# EAGLE design seletor (EAGLE 7.6.0)
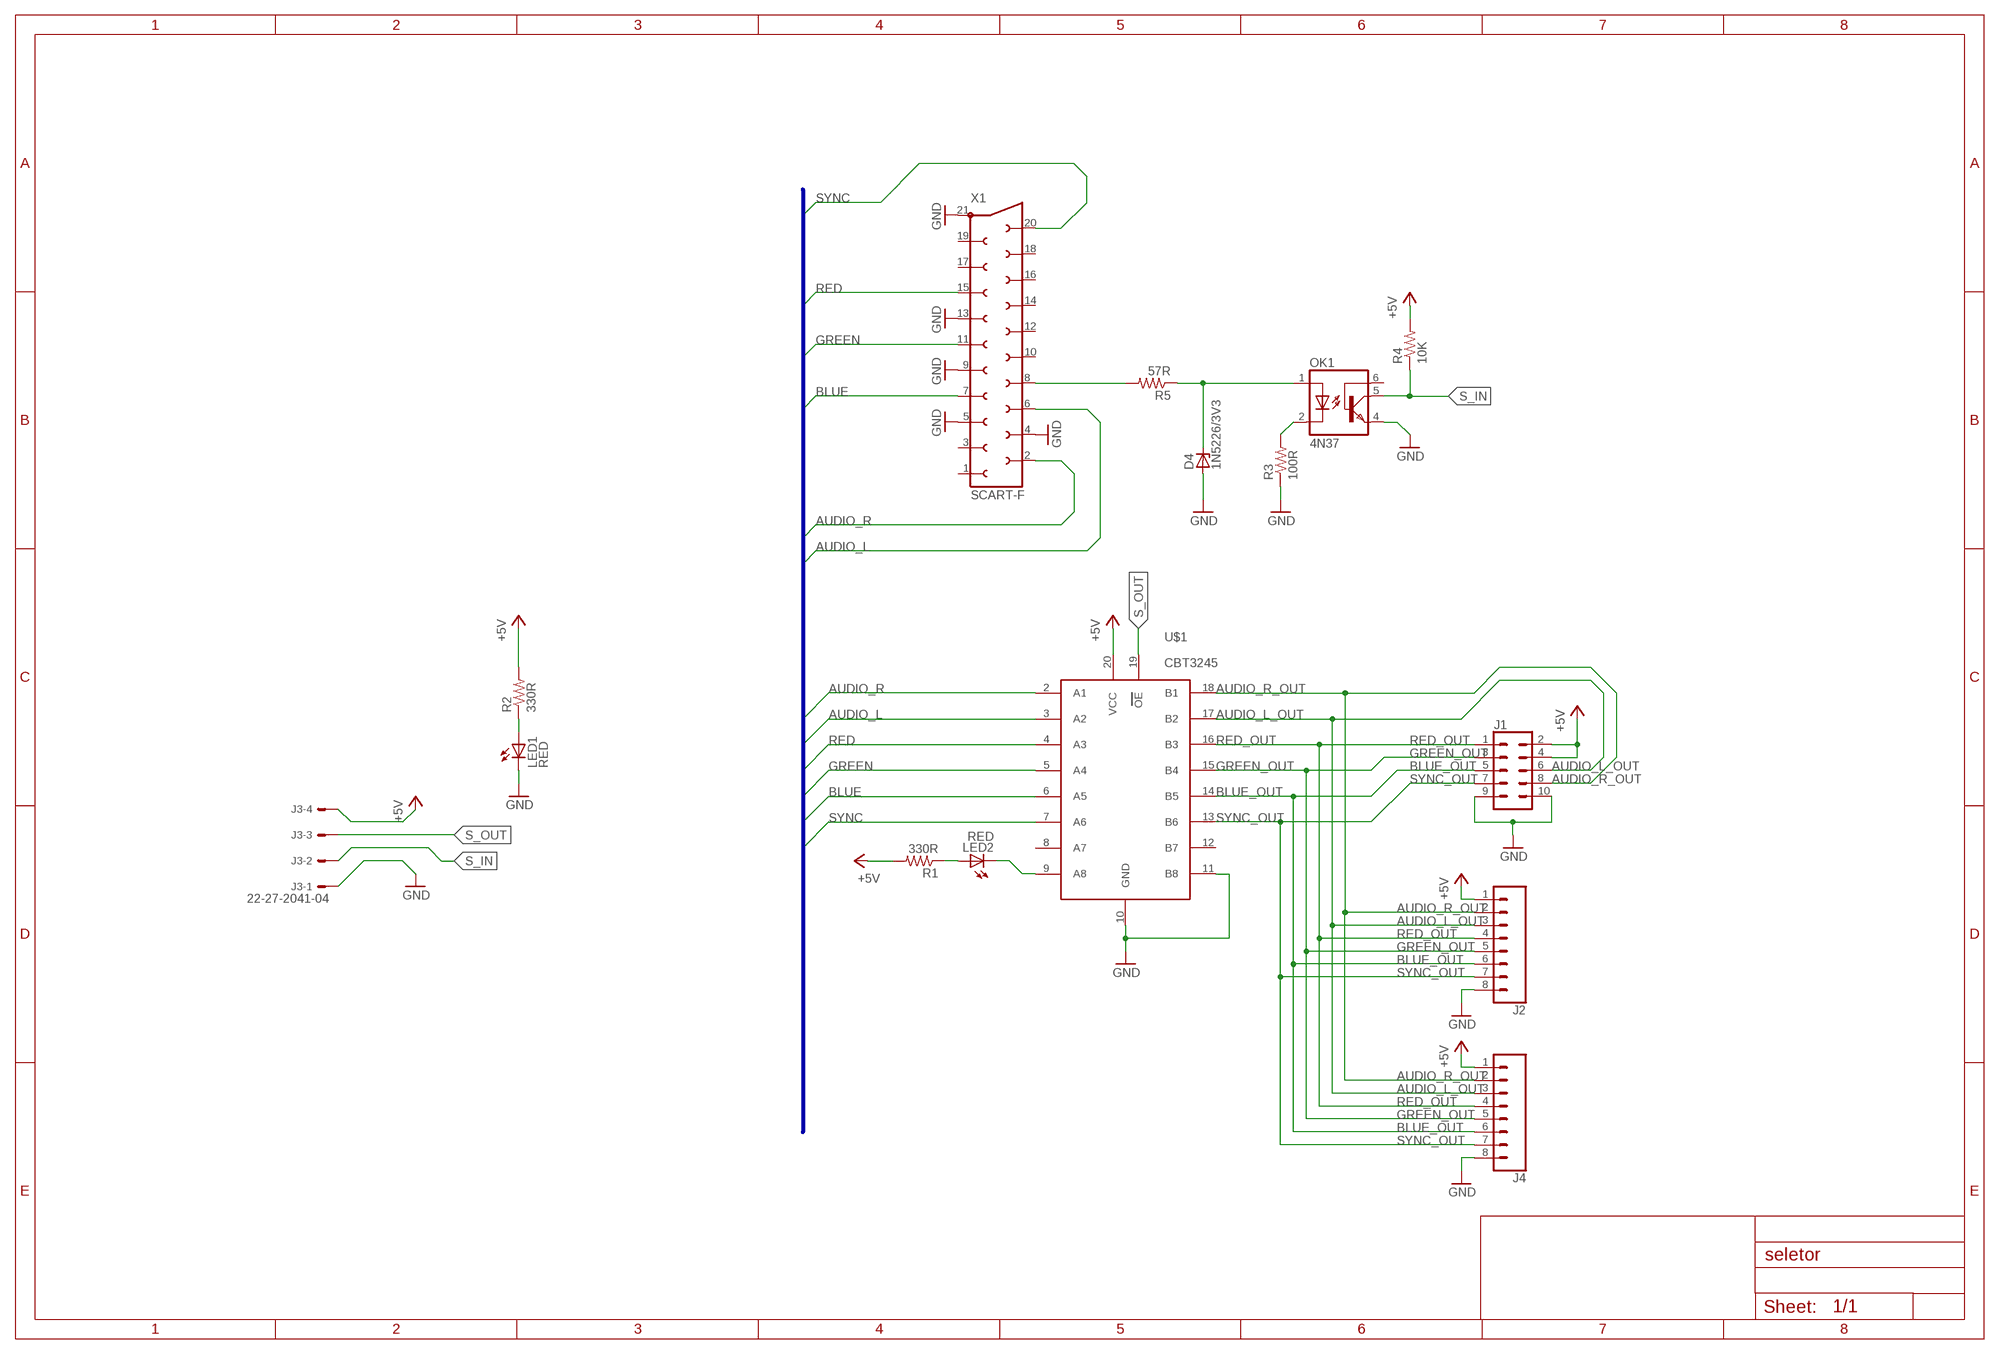
[diagram p0: schematic, sheet 1]

## Parts
D4  1N5226/3V3  BZX90  [DO34Z7]
J1  CONN_05X2SHD  [2X5-SHROUDED]
J2  CONN_08"  [1X08]
J3  22-27-2041-04  [6410-04]
J4  CONN_08"  [1X08]
LED1  RED  LED5MM  [LED5MM]
LED2  RED  LED5MM  [LED5MM]
OK1  4N37  [DIL06]
R1  330R  R-US_0204/2V  [0204V]
R2  330R  R-US_0204/2V  [0204V]
R3  100R  R-US_0204/2V  [0204V]
R4  10K  R-US_0204/2V  [0204V]
R5  57R  R-US_0204/7  [0204/7]
U$1  CBT3245  [SO20]
X1  SCART-F  [SCART-F]

## Nets
+5V [POWER]: J1.2 J1.4 J2.1 J3.4 J4.1 R1.2 R2.2 R4.2 U$1.20(VCC)
AUDIO_L [singal]: U$1.3(A2) X1.6
AUDIO_L_OUT [singal]: J1.6 J2.3 J4.3 U$1.17(B2)
AUDIO_R [singal]: U$1.2(A1) X1.2
AUDIO_R_OUT: J1.8 J2.2 J4.2 U$1.18(B1)
BLUE [singal]: U$1.6(A5) X1.7
BLUE_OUT: J1.5 J2.6 J4.6 U$1.14(B5)
GND [POWER]: D4.A J1.9 J1.10 J2.8 J3.1 J4.8 LED1.K(C) OK1.4(EMI) R3.1 U$1.10(GND) U$1.11(B8) X1.4 X1.5 X1.9 X1.13 X1.21
GREEN [singal]: U$1.5(A4) X1.11
GREEN_OUT: J1.3 J2.5 J4.5 U$1.15(B4)
N$3: LED1.A R2.1
N$4: D4.C OK1.1(A) R5.1
N$5: OK1.2(C) R3.2
N$6: R5.2 X1.8
N$8: LED2.A R1.1
N$12: LED2.K(C) U$1.9(A8)
RED [singal]: U$1.4(A3) X1.15
RED_OUT: J1.1 J2.4 J4.4 U$1.16(B3)
S_IN: J3.2 OK1.5(COL) R4.1
S_OUT: J3.3 U$1.19(OE)
SYNC [singal]: U$1.7(A6) X1.20
SYNC_OUT: J1.7 J2.7 J4.7 U$1.13(B6)
Unconnected: OK1.6(BAS) U$1.8(A7) U$1.12(B7) X1.1 X1.3 X1.10 X1.12 X1.14 X1.16 X1.17 X1.18 X1.19

## Buses
B$1

## Library data of the parts
D4 = diode:BZX90: Z DIODE
J1 = SparkFun-Connectors:CONN_05X2: Multi connection point. Often used as Generic Header-pin footprint for 0.1 inch spaced/style header connections For AVR SPI programming port, see special device with nice symbol: "AVR_SPI_PROG_5x2.dev" You can populate with any combo of single row headers, but if you'd like an exact match, check these: 2x5 AVR ICSP Male Header <https://www.sparkfun.com/products/778> (PRT-00778) 2x5 Pin Shrouded Header <https://www.sparkfun.com/products/8506> (PRT-08506) On any of the 0.1 inch spaced packages, you can populate with these: Break Away Headers - Straight <https://www.sparkfun.com/products/116> (PRT-00116) Break Away Male Headers - Right Angle <https://www.sparkfun.com/products/553> (PRT-00553) Female Headers <https://www.sparkfun.com/products/115> (PRT-00115) Break Away Headers - Machine Pin <https://www.sparkfun.com/products/117> (PRT-00117) Break Away Female Headers - Swiss Machine Pin <https://www.sparkfun.com/products/743> (PRT-00743) Special note: the shrouded connector mates well with our 5x2 ribbon cables: 2x5 Pin IDC Ribbon Cable <https://www.sparkfun.com/products/8535> (PRT-08535); PROD_ID: CONN-08671; SF_ID: PRT-08506
J2 J4 = SparkFun-Connectors:CONN_08: Multi connection point. Often used as Generic Header-pin footprint for 0.1 inch spaced/style header connections On any of the 0.1 inch spaced packages, you can populate with these: Break Away Headers - Straight <https://www.sparkfun.com/products/116> (PRT-00116) Break Away Male Headers - Right Angle <https://www.sparkfun.com/products/553> (PRT-00553) Female Headers <https://www.sparkfun.com/products/115> (PRT-00115) Break Away Headers - Machine Pin <https://www.sparkfun.com/products/117> (PRT-00117) Break Away Female Headers - Swiss Machine Pin <https://www.sparkfun.com/products/743> (PRT-00743) Arduino Stackable Header - 8 Pin <https://www.sparkfun.com/products/9279> (PRT-09279) For SCREWTERMINALS and SPRING TERMINALS visit here: Screw Terimnals on SparkFun.com <https://www.sparkfun.com/search/results?term=Screw+Terminals> (5mm/3.5mm/2.54mm spacing) This device is also useful as a general connection point to wire up your design to another part of your project. Our various solder wires solder well into these plated through hole pads. Hook-Up Wire - Assortment (Stranded, 22 AWG) <https://www.sparkfun.com/products/11375> (PRT-11375) Hook-Up Wire - Assortment (Solid Core, 22 AWG) <https://www.sparkfun.com/products/11367> (PRT-11367) View the entire wire category on our website here <https://www.sparkfun.com/categories/141> Special notes: Molex polarized connector foot print use with SKU : PRT-08231 with associated crimp pins and housings. 1MM SMD Version SKU: PRT-10208 NOTES ON THE VARIANTS LOCK and LOCK_LONGPADS... This footprint was designed to help hold the alignment of a through-hole component (i.e. 6-pin header) while soldering it into place. You may notice that each hole has been shifted either up or down by 0.005 of an inch from it's more standard position (which is a perfectly straight line). This slight alteration caused the pins (the squares in the middle) to touch the edges of the holes. Because they are alternating, it causes a "brace" to hold the component in place. 0.005 has proven to be the perfect amount of "off-center" position when using our standard breakaway headers. Although looks a little odd when you look at the bare footprint, once you have a header in there, the alteration is very hard to notice. Also,if you push a header all the way into place, it is covered up entirely on the bottom side.; PROD_ID: CONN-08438
J3 = con-molex:22-?-04: CONNECTOR wire to board 2.54 mm (.1 inch) pitch header; OC_FARNELL: unknown; OC_NEWARK: unknown
LED1 LED2 = led:LED: LED OSRAM: - CHIPLED LG R971, LG N971, LY N971, LG Q971, LY Q971, LO R971, LY R971 LH N974, LH R974 LS Q976, LO Q976, LY Q976 LO Q996 - Hyper CHIPLED LW Q18S LB Q993, LB Q99A, LB R99A - SideLED LS A670, LO A670, LY A670, LG A670, LP A670 LB A673, LV A673, LT A673, LW A673 LH A674 LY A675 LS A676, LA A676, LO A676, LY A676, LW A676 LS A679, LY A679, LG A679 - Hyper Micro SIDELED® LS Y876, LA Y876, LO Y876, LY Y876 LT Y87S - SmartLED LW L88C, LW L88S LB L89C, LB L89S, LG L890 LS L89K, LO L89K, LY L89K LS L896, LA L896, LO L896, LY L896 - TOPLED LS T670, LO T670, LY T670, LG T670, LP T670 LSG T670, LSP T670, LSY T670, LOP T670, LYG T670 LG T671, LOG T671, LSG T671 LB T673, LV T673, LT T673, LW T673 LH T674 LS T676, LA T676, LO T676, LY T676, LB T676, LH T676, LSB T676, LW T676 LB T67C, LV T67C, LT T67C, LS T67K, LO T67K, LY T67K, LW E67C LS E67B, LA E67B, LO E67B, LY E67B, LB E67C, LV E67C, LT E67C LW T67C LS T679, LY T679, LG T679 LS T770, LO T770, LY T770, LG T770, LP T770 LB T773, LV T773, LT T773, LW T773 LH T774 LS E675, LA E675, LY E675, LS T675 LS T776, LA T776, LO T776, LY T776, LB T776 LHGB T686 LT T68C, LB T68C - Hyper Mini TOPLED® LB M676 - Mini TOPLED Santana® LG M470 LS M47K, LO M47K, LY M47K Source: http://www.osram.convergy.de LUXEON: - LUMILED® LXK2-PW12-R00, LXK2-PW12-S00, LXK2-PW14-U00, LXK2-PW14-V00 LXK2-PM12-R00, LXK2-PM12-S00, LXK2-PM14-U00 LXK2-PE12-Q00, LXK2-PE12-R00, LXK2-PE12-S00, LXK2-PE14-T00, LXK2-PE14-U00 LXK2-PB12-K00, LXK2-PB12-L00, LXK2-PB12-M00, LXK2-PB14-N00, LXK2-PB14-P00, LXK2-PB14-Q00 LXK2-PR12-L00, LXK2-PR12-M00, LXK2-PR14-Q00, LXK2-PR14-R00 LXK2-PD12-Q00, LXK2-PD12-R00, LXK2-PD12-S00 LXK2-PH12-R00, LXK2-PH12-S00 LXK2-PL12-P00, LXK2-PL12-Q00, LXK2-PL12-R00 Source: www.luxeon.com KINGBRIGHT: KA-3528ASYC Source: www.kingbright.com
OK1 = optocoupler:4N37: OPTO COUPLER Source: http://www.fairchildsemi.com/pf/4N/4N35-M.html; MF: FAIRCHILD SEMICONDUCTOR; MPN: 4N37; OC_FARNELL: 1612456; OC_NEWARK: 72K9948
R1-R5 = rcl:R-US_: RESISTOR, American symbol
U$1 = CBT3245:CBT3245
X1 = con-hirschmann:SCART-F: TV SCART CONNECTOR; OC_FARNELL: unknown; OC_NEWARK: unknown

## Net classes
0 default: width 0.406 mm
1 singal: width 0.5 mm
2 POWER: width 0.5 mm

## Board
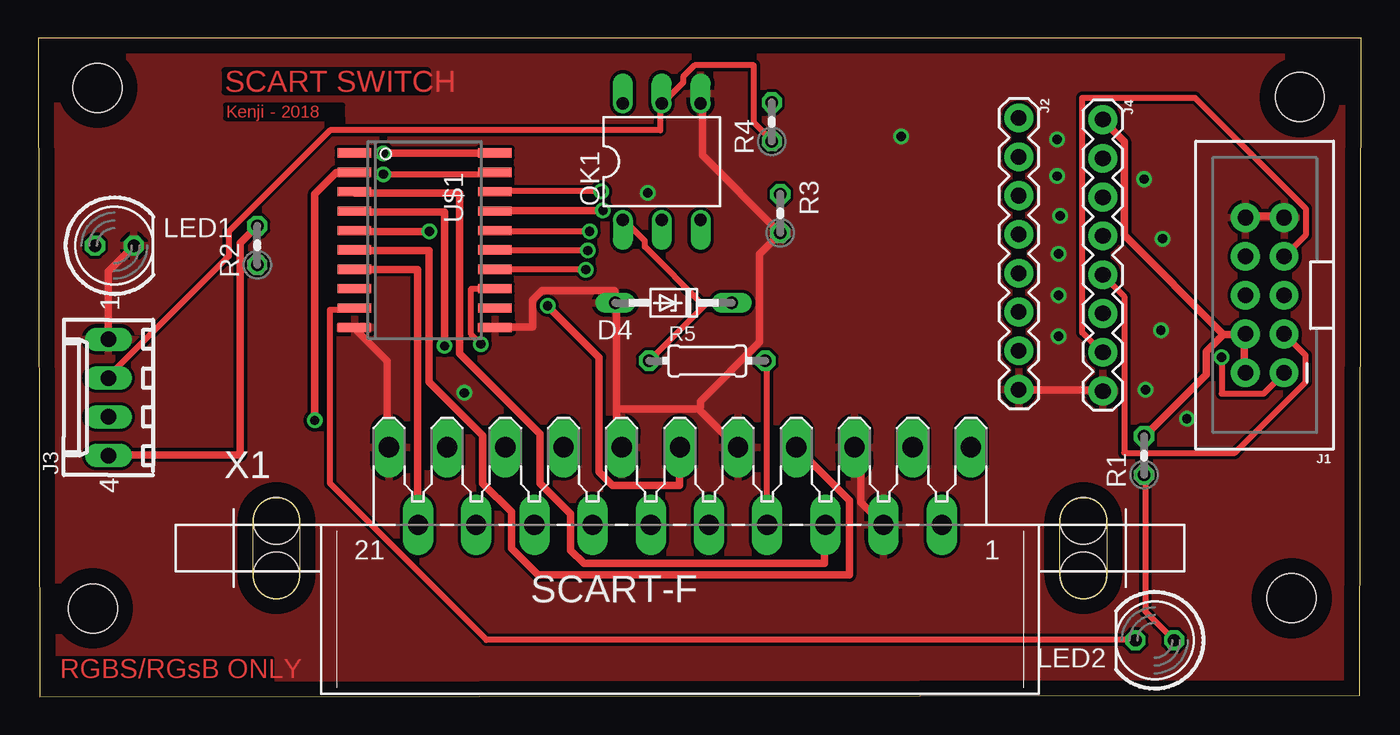
[diagram p1: board, top side]
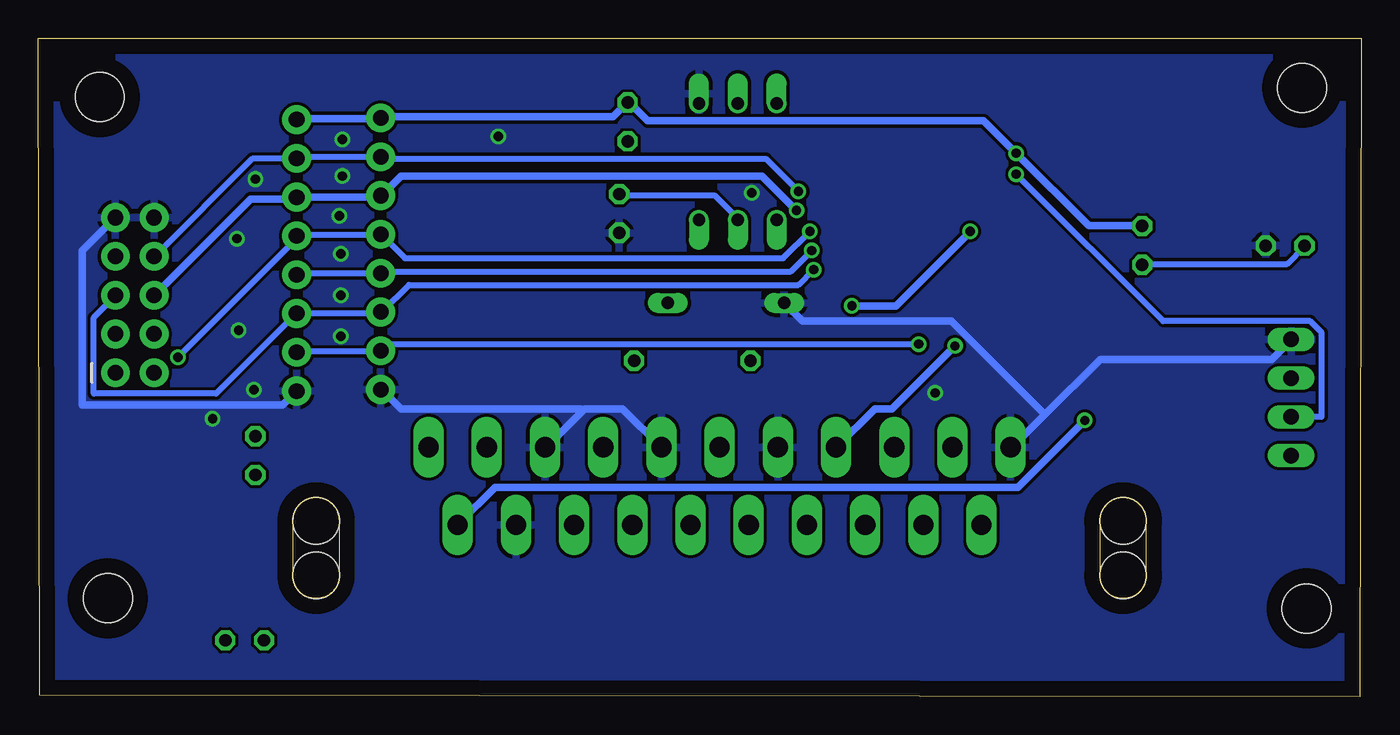
[diagram p2: board, bottom side, seen from below]

Size 86.62 x 43.13 mm. Coordinates in mm from the lower left corner, seen from the top.
Outline: 0.1,0 86.52,0.1 86.62,43.13 0,43.13 0.1,0
Copper layers (1*16): Top 0.035mm / dielectric 1.5mm / Bottom 0.035mm
Design rules "default": minimum track width 10mil, minimum drill 24mil, track to track 8mil, track to pad 8mil, pad to pad 8mil, via to via 8mil, smd to smd 8mil, copper to edge 40mil, drill to drill 8mil, minimum pad ring 10mil, minimum via ring 8mil, stop-mask expansion 4mil, vias tented up to drill 0mil, thermal gap 10mil
Holes 3.2 mm at 3.58,5.78 82.06,6.45 3.88,39.88 82.59,39.28

### Footprints (pad centres in the part's own frame; a part is rotated, then mirrored left to right if it is on the bottom)
DO34Z7 = drill 0.813 long: A 3.81,0; C -3.81,0
2X5-SHROUDED = drill 1.016 pad 1.88: 1 -1.27,5.08; 2 1.27,5.08; 3 -1.27,2.54; 4 1.27,2.54; 5 -1.27,0; 6 1.27,0; 7 -1.27,-2.54; 8 1.27,-2.54; 9 -1.27,-5.08; 10 1.27,-5.08
1X08 = drill 1.016 pad 1.88: 1 0,0; 2 2.54,0; 3 5.08,0; 4 7.62,0; 5 10.16,0; 6 12.7,0; 7 15.24,0; 8 17.78,0
6410-04 = drill 1.016 long: 1 3.81,0; 2 1.27,0; 3 -1.27,0; 4 -3.81,0
LED5MM = drill 0.813 octagon: A -1.27,0; K 1.27,0
DIL06 = drill 0.813 offset: 1 -2.54,-3.81; 2 0,-3.81; 3 2.54,-3.81; 4 2.54,3.81; 5 0,3.81; 6 -2.54,3.81
0204V = drill 0.813 octagon: 1 -1.27,0; 2 1.27,0
0204/7 = drill 0.813 octagon: 1 -3.81,0; 2 3.81,0
SO20 = smd 0.6 x 2.2: 1 -5.715,-4.6; 2 -4.445,-4.6; 3 -3.175,-4.6; 4 -1.905,-4.6; 5 -0.635,-4.6; 6 0.635,-4.6; 7 1.905,-4.6; 8 3.175,-4.6; 9 4.445,-4.6; 10 5.715,-4.6; 11 5.715,4.6; 12 4.445,4.6; 13 3.175,4.6; 14 1.905,4.6; 15 0.635,4.6; 16 -0.635,4.6; 17 -1.905,4.6; 18 -3.175,4.6; 19 -4.445,4.6; 20 -5.715,4.6
SCART-F = drill 1.321 long: 1 19.05,5.08; 2 17.145,0; 3 15.24,5.08; 4 13.335,0; 5 11.43,5.08; 6 9.525,0; 7 7.62,5.08; 8 5.715,0; 9 3.81,5.08; 10 1.905,0; 11 0,5.08; 12 -1.905,0; 13 -3.81,5.08; 14 -5.715,0; 15 -7.62,5.08; 16 -9.525,0; 17 -11.43,5.08; 18 -13.335,0; 19 -15.24,5.08; 20 -17.145,0; 21 -19.05,5.08 | hole 3.023: 26.416,0.254; 26.416,-3.302; -26.416,0.254; -26.416,-3.302

### Placement (x,y rotation side)
D4  41.6,25.8 180 top
J1  80.3,26.3 180 top
J2  64.2,37.9 270 top
J3  4.6,19.6 90 top
J4  69.7,37.8 270 top
LED1  4.99,29.54 0 top
LED2  73.1,3.7 180 top
OK1  40.82,35.04 0 top
R1  72.4,15.8 90 top
R2  14.34,29.56 90 top
R3  48.58,31.65 90 top
R4  48.03,37.65 90 top
R5  43.8,22 0 top
U$1  25.3,29.9 270 top
X1  42.01,11.26 0 top

### Tracks (layer width: path | path; a pad name or v marks a point on that pad's centre or on a via)
+5V  (via drill 0.61)
  Top 0.5: v22.6,35.6 29.85,35.6 U$1.20 | J3.4 4.6,15.85 13.22,15.85 13.22,29.73 14.22,30.73 R2.2 | 77.6,23.73 76.47,22.6 76.47,21.1 72.47,17.1 R1.2 | 77.6,23.73 78.97,23.73 J1.4 78.97,23.48 78.97,21.23 J1.2 | 77.6,23.73 71.1,30.23 71.1,36.35 69.72,37.73 J4.1
  Bottom 0.5: R2.2 14.35,30.85 17.85,30.85 v22.6,35.6 24.73,37.73 46.73,37.73 47.85,38.85 R4.2 48.98,37.98 64.1,37.98 J2.1 64.35,37.85 69.6,37.85 J4.1
AUDIO_L
  Top 0.5: U$1.3 20.73,32.98 27.6,32.98 27.6,22.48 32.85,17.23 32.85,13.97 34.85,11.97 34.85,9.6 35.73,8.72 51.48,8.72 51.48,11.22 X1.6
AUDIO_L_OUT  (via drill 0.61)
  Top 0.5: v36.98,31.85 29.98,31.85 U$1.17
  Bottom 0.5: v36.98,31.85 39.23,34.1 62.85,34.1 64.1,32.85 J2.3 64.35,32.73 69.6,32.73 J4.3 69.85,32.6 72.72,32.6 78.97,26.35 J1.6
AUDIO_R  (via drill 0.61)
  Top 0.5: v18.1,18.1 18.1,32.93 19.5,34.33 U$1.2
  Bottom 0.5: v18.1,18.1 22.48,13.72 56.73,13.72 59.1,11.35 X1.2
AUDIO_R_OUT  (via drill 0.61)
  Top 0.406: v36.85,33.1 29.98,33.1 U$1.18
  Bottom 0.406: v36.85,33.1 38.98,35.23 63.98,35.23 64.1,35.35 J2.2 64.35,35.35 69.6,35.35 J4.2 69.85,35.23 72.6,35.23 78.97,28.85 J1.8
BLUE
  Top 0.5: U$1.6 20.73,29.23 25.6,29.23 25.6,20.6 29.1,17.1 29.1,13.97 30.98,12.1 30.98,9.72 32.73,7.97 53.1,7.97 53.1,12.85 49.73,16.23 X1.7
BLUE_OUT  (via drill 0.61)
  Top 0.406: v35.85,27.98 29.98,27.98 U$1.14
  Bottom 0.406: v35.85,27.98 36.85,26.98 62.35,26.98 64.1,25.23 J2.6 64.35,25.1 J4.6 69.85,24.98 74.97,19.85 82.97,19.85 82.97,24.85 81.6,26.23 J1.5
GND  (via drill 0.61)
  Top 0.5: J3.1 4.6,27.85 6.22,29.48 LED1.K | U$1.10 20.73,24.1 22.85,21.98 22.85,16.35 X1.21 | J1.10 79.1,31.48 81.47,31.48 J1.9 | J4.8 69.6,20.1 64.22,20.1 J2.8 | OK1.4 43.48,38.85 43.48,35.48 48.48,30.48 R3.1 48.48,30.23 47.23,28.98 47.23,23.23 43.35,19.35 43.35,18.98 43.23,18.85 | X1.4 55.23,11.35 53.85,12.72 53.85,15.85 53.48,16.23 X1.5 | U$1.11 29.98,24.23 32.35,24.23 32.35,25.98 32.98,26.6 37.73,26.6 37.73,25.85 D4.A 37.85,25.6 37.85,18.85 | 37.85,18.85 37.85,16.6 38.1,16.35 X1.13 | 43.23,18.85 45.73,16.35 X1.9 | 37.85,18.85 43.23,18.85
  Bottom 0.5: 20.73,18.48 22.85,16.35 X1.21 | 20.73,18.48 17.1,22.1 5.85,22.1 4.6,23.35 J3.1 | J1.9 83.72,29.23 83.72,19.1 70.6,19.1 69.72,19.98 J4.8 | 50.98,18.73 50.85,18.85 48.35,18.85 45.85,16.35 X1.9 | 50.98,18.73 53.35,16.35 X1.5 | J2.8 64.1,20.1 62.85,18.85 51.1,18.85 50.98,18.73 | 20.73,18.48 26.85,24.6 36.6,24.6 37.73,25.73 D4.A
  other vias: 73.5,24 72.5,20.1 56.5,36.7 66.7,34.1 66.8,29 73.6,30 66.8,26.3 66.8,23.6 39.9,33 66.7,36.5 66.9,31.5 72.4,33.9 75.2,18.2 27.9,19.9
  pour Bottom: 0,43.1 86.5,43.1 86.5,0.1 0,0.1
  pour Top: 0,43.1 86.5,43.1 86.5,0.1 0,0.1
GREEN  (via drill 0.61)
  Top 0.5: v25.6,30.48 20.73,30.48 U$1.5 | v33.35,25.6 36.73,22.23 36.73,14.72 37.6,13.85 41.98,13.85 41.98,16.23 X1.11
  Bottom 0.5: v25.6,30.48 30.48,25.6 v33.35,25.6
GREEN_OUT  (via drill 0.61)
  Top 0.406: v35.98,29.23 29.98,29.23 U$1.15 | J1.3 81.6,23.73 82.97,22.35 82.97,20.6 78.35,15.97 71.1,15.97 71.1,26.23 69.72,27.6 J4.5
  Bottom 0.406: v35.98,29.23 37.35,27.85 64.1,27.85 J2.5 64.35,27.73 69.6,27.73 J4.5
N$3
  Bottom 0.406: LED1.A 3.73,29.48 4.85,28.35 14.22,28.35 R2.1
N$4
  Top 0.406: 43.6,25.6 43.73,25.73 45.35,25.73 D4.C | 43.6,25.6 40.1,22.1 R5.1 | 43.6,25.6 39.73,29.48 39.73,29.85 38.35,31.23 OK1.1
N$5
  Bottom 0.406: OK1.2 40.85,31.35 42.35,32.85 48.48,32.85 R3.2
N$6
  Top 0.406: X1.8 47.73,21.98 R5.2
N$8
  Top 0.406: LED2.A 74.35,3.73 72.47,5.6 72.47,14.47 R1.1
N$12
  Top 0.406: U$1.9 20.6,25.35 19.1,25.35 19.1,13.97 29.35,3.73 71.72,3.73 LED2.K
RED  (via drill 0.61)
  Top 0.5: v26.6,22.98 26.6,31.73 20.73,31.73 U$1.4
  Bottom 0.5: v26.6,22.98 30.73,18.85 31.85,18.85 34.35,16.35 X1.15
RED_OUT  (via drill 0.61)
  Top 0.406: v36.1,30.48 29.98,30.48 U$1.16 | v77.47,22.23 77.47,19.85 80.22,19.85 81.47,21.1 J1.1
  Bottom 0.406: v36.1,30.48 37.85,28.73 62.6,28.73 64.1,30.23 J2.4 64.35,30.23 69.6,30.23 J4.4 69.72,29.98 v77.47,22.23
S_IN
  Top 0.406: R4.1 47.98,36.48 46.85,37.6 46.85,41.35 42.98,41.35 42.23,40.6 42.23,40.23 40.85,38.85 OK1.5 40.73,38.73 40.73,37.1 19.1,37.1 12.47,30.48 12.47,28.85 4.6,20.98 J3.2
S_OUT  (via drill 0.61)
  Top 0.406: v22.6,34.23 29.85,34.23 U$1.19
  Bottom 0.406: v22.6,34.23 12.97,24.6 3.35,24.6 2.6,23.85 2.6,18.35 4.6,18.35 J3.3
SYNC
  Top 0.5: U$1.7 20.73,27.98 24.85,27.98 24.85,11.35 X1.20
SYNC_OUT  (via drill 0.61)
  Top 0.406: U$1.13 28.35,26.73 28.35,23.73 v28.98,23.1 | J1.7 81.6,28.85 82.97,30.23 82.97,31.98 75.72,39.23 68.35,39.23 68.35,23.85 69.6,22.6 J4.7
  Bottom 0.406: v28.98,23.1 63.73,23.1 64.1,22.73 J2.7 64.35,22.6 69.6,22.6 J4.7

### Text on the board
Top: SCART SWITCH | Kenji - 2018 | RGBS/RGsB ONLY